# Altium schematic sheet 0_ADSTM32-Overview.SchDoc
size A; SheetNumber: 1; SheetTotal: 4
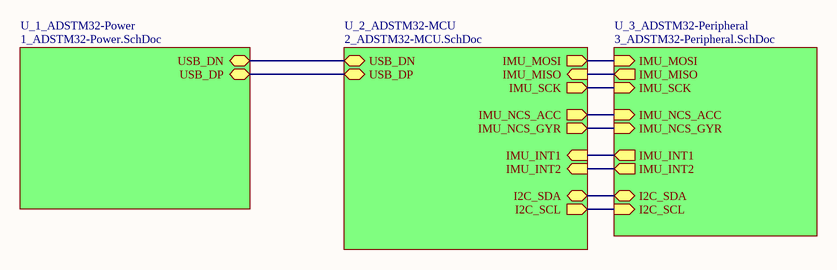
[diagram p0: 0_ADSTM32-Overview.SchDoc]

## Sub-sheets
U_1_ADSTM32-Power = 1_ADSTM32-Power.SchDoc: USB_DP (bidir), USB_DN (bidir)
U_2_ADSTM32-MCU = 2_ADSTM32-MCU.SchDoc: USB_DN (bidir), USB_DP (bidir), IMU_MISO (in), IMU_SCK (out), IMU_MOSI (out), IMU_NCS_ACC (out), IMU_NCS_GYR (out), I2C_SCL (out), I2C_SDA (bidir), IMU_INT1 (in), IMU_INT2 (in)
U_3_ADSTM32-Peripheral = 3_ADSTM32-Peripheral.SchDoc: IMU_MISO (out), IMU_SCK (in), IMU_MOSI (in), IMU_NCS_ACC (in), IMU_NCS_GYR (in), IMU_INT1 (out), IMU_INT2 (out), I2C_SCL (in), I2C_SDA (bidir)

## Nets
(unnamed): sheet U_1_ADSTM32-Power/USB_DP, sheet U_2_ADSTM32-MCU/USB_DP
(unnamed): sheet U_1_ADSTM32-Power/USB_DN, sheet U_2_ADSTM32-MCU/USB_DN
(unnamed): sheet U_2_ADSTM32-MCU/IMU_MISO, sheet U_3_ADSTM32-Peripheral/IMU_MISO
(unnamed): sheet U_2_ADSTM32-MCU/IMU_SCK, sheet U_3_ADSTM32-Peripheral/IMU_SCK
(unnamed): sheet U_2_ADSTM32-MCU/IMU_MOSI, sheet U_3_ADSTM32-Peripheral/IMU_MOSI
(unnamed): sheet U_2_ADSTM32-MCU/IMU_NCS_ACC, sheet U_3_ADSTM32-Peripheral/IMU_NCS_ACC
(unnamed): sheet U_2_ADSTM32-MCU/IMU_NCS_GYR, sheet U_3_ADSTM32-Peripheral/IMU_NCS_GYR
(unnamed): sheet U_2_ADSTM32-MCU/I2C_SCL, sheet U_3_ADSTM32-Peripheral/I2C_SCL
(unnamed): sheet U_2_ADSTM32-MCU/I2C_SDA, sheet U_3_ADSTM32-Peripheral/I2C_SDA
(unnamed): sheet U_2_ADSTM32-MCU/IMU_INT1, sheet U_3_ADSTM32-Peripheral/IMU_INT1
(unnamed): sheet U_2_ADSTM32-MCU/IMU_INT2, sheet U_3_ADSTM32-Peripheral/IMU_INT2